# EasyEDA schematic MOTOR_CONTROL.json
TITLE: MOTOR CONTROL; REV: o.0; Date: 2022-07-04; Sheet: 1/1; Drawn By: AmirB@mada.org.il; Company: Blomfield Science Museum
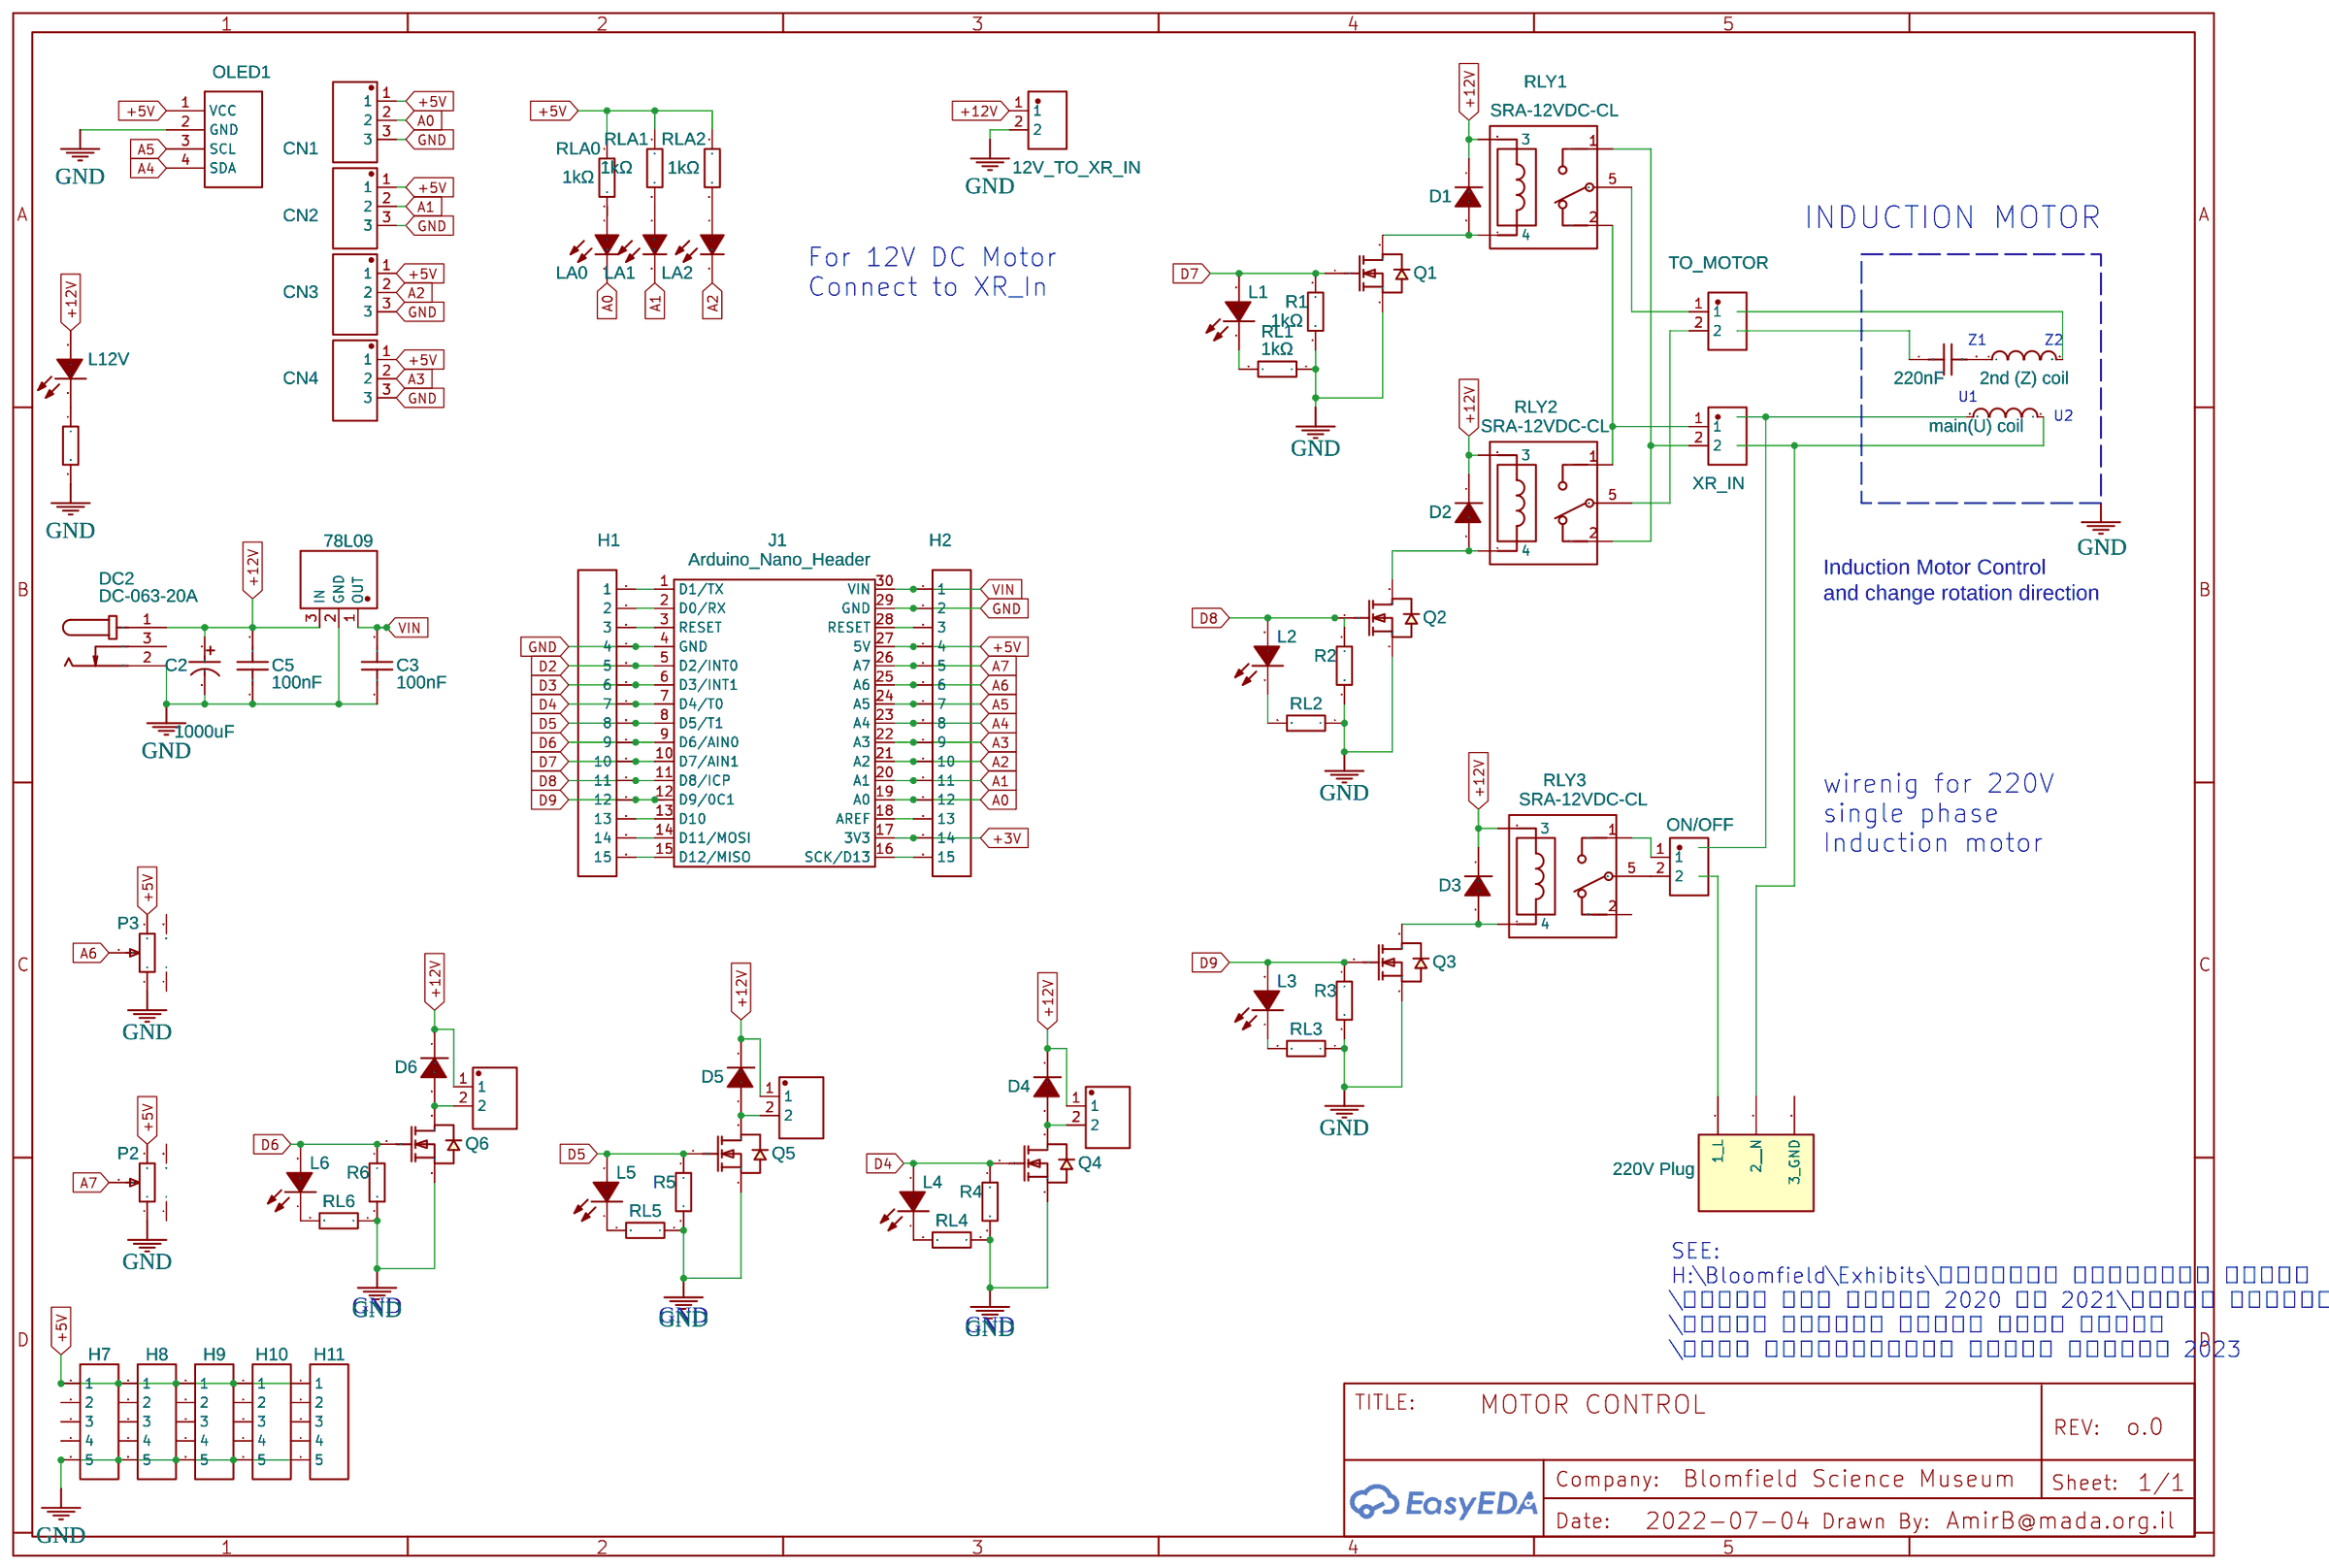
[diagram p0: schematic sheet]

## Parts
12V_TO_XR_IN  12V_TO_R  [CONN-TH_P5.00_KF301-5.0-2P]
ACON1  KF2510-2A  [CONN-TH_KF2510-2A]
ACON2  KF2510-2A  [CONN-TH_KF2510-2A]
ACON3  KF2510-2A  [CONN-TH_KF2510-2A]
C2  1000uF  [CAP-TH_BD12.5-P5.00-D0.6-FD]
C3  100nF  [C0603]
C4  220nF  [C0603]
C5  100nF  [C0603]
CN1  KF2510-3PFlat knitting needle  [CONN-TH_KF2510-3AW]
CN2  KF2510-3PFlat knitting needle  [CONN-TH_KF2510-3AW]
CN3  KF2510-3PFlat knitting needle  [CONN-TH_KF2510-3AW]
CN4  KF2510-3PFlat knitting needle  [CONN-TH_KF2510-3AW]
CR3  ON/OFF  [CONN-TH_P5.00_KF301-5.0-2P]
D1  M7_C95872  [SMA_L4.3-W2.6-LS5.2-RD]
D2  M7_C95872  [SMA_L4.3-W2.6-LS5.2-RD]
D3  M7_C95872  [SMA_L4.3-W2.6-LS5.2-RD]
D4  M7_C95872  [SMA_L4.3-W2.6-LS5.2-RD]
D5  M7_C95872  [SMA_L4.3-W2.6-LS5.2-RD]
D6  M7_C95872  [SMA_L4.3-W2.6-LS5.2-RD]
DC2  DC-063-20A  [DC-IN-TH_DC-063-20A]
H1  HDR-F-2.54_1x15  [HDR-F-2.54_1X15]
H2  HDR-F-2.54_1x15  [HDR-F-2.54_1X15]
H7  HDR-F-2.54_1x5  [HDR-F-2.54_1X5]
H8  HDR-F-2.54_1x5  [HDR-F-2.54_1X5]
H9  HDR-F-2.54_1x5  [HDR-F-2.54_1X5]
H10  HDR-F-2.54_1x5  [HDR-F-2.54_1X5]
H11  HDR-F-2.54_1x5  [HDR-F-2.54_1X5]
J1  Arduino_Nano_Header  [DIP-30_L43.18-W15.24-ARDUINONANO]
L1  FC-2012HRK-620D  [LED0805-RD_RED]
L2  FC-2012HRK-620D  [LED0805-RD_RED]
L3  FC-2012HRK-620D  [LED0805-RD_RED]
L4  FC-2012HRK-620D  [LED0805-RD_RED]
L5  FC-2012HRK-620D  [LED0805-RD_RED]
L6  FC-2012HRK-620D  [LED0805-RD_RED]
L9  main(U) coil  [L0603]
L10  2nd (Z) coil  [L0603]
L12V  FC-2012HRK-620D  [LED0805-RD_RED]
LA0  19-217/BHC-ZL1M2RY/3T  [LED0603-R-RD_BLUE]
LA1  19-217/BHC-ZL1M2RY/3T  [LED0603-R-RD_BLUE]
LA2  19-217/BHC-ZL1M2RY/3T  [LED0603-R-RD_BLUE]
OLED1  1.3 inch OLED SSH1106 I2C 128x64 copy  [1.3_OLED_SSH1106_I2C_128X64_BOARD]
P2  长柄旋转电位器  [RES-ADJ-TH_RV09]
P3  长柄旋转电位器  [RES-ADJ-TH_RV09]
P4  220V Plug  [MAIN VOLTAGE PLUG 1]
Q1  AO3400A  [SOT-23-3_L2.9-W1.6-P1.90-LS2.8-BR]
Q2  AO3400A  [SOT-23-3_L2.9-W1.6-P1.90-LS2.8-BR]
Q3  AO3400A  [SOT-23-3_L2.9-W1.6-P1.90-LS2.8-BR]
Q4  AO3400A  [SOT-23-3_L2.9-W1.6-P1.90-LS2.8-BR]
Q5  AO3400A  [SOT-23-3_L2.9-W1.6-P1.90-LS2.8-BR]
Q6  AO3400A  [SOT-23-3_L2.9-W1.6-P1.90-LS2.8-BR]
R1  1kΩ  [R0603]
R2  1kΩ  [R0603]
R3  1kΩ  [R0603]
R4  1kΩ  [R0603]
R5  1kΩ  [R0603]
R6  1kΩ  [R0603]
RL1  1kΩ  [R0603]
RL2  1kΩ  [R0603]
RL3  1kΩ  [R0603]
RL4  1kΩ  [R0603]
RL5  1kΩ  [R0603]
RL6  1kΩ  [R0603]
RL12V  R10K  [R0603]
RLA0  1kΩ  [R0603]
RLA1  1kΩ  [R0603]
RLA2  1kΩ  [R0603]
RLY1  SRA-12VDC-CL  [RELAY-TH_SRA-X-CX]
RLY2  SRA-12VDC-CL  [RELAY-TH_SRA-X-CX]
RLY3  SRA-12VDC-CL  [RELAY-TH_SRA-X-CX]
TO_MOTOR  TO_MOTOR  [CONN-TH_P5.00_KF301-5.0-2P]
U5  78L09  [SOT-89-3_L4.5-W2.5-P1.50-LS4.0-BR]
XR_IN  XR_IN  [CONN-TH_P5.00_KF301-5.0-2P]

## Library data of the parts
12V_TO_XR_IN CR3 TO_MOTOR XR_IN = KF301-5.0-2P: Supplier: LCSC; Supplier Part: C474881; Manufacturer: Cixi Kefa Elec; Contributor: LCSC; JLCPCB Part Class: Extended Part; Package Display: No
ACON1-ACON3 = KF2510-2A: Supplier: LCSC; Manufacturer: BOOMELE; Supplier Part: C27543; JLCPCB Part Class: Extended Part; Package Display: No
C2 = 1000uF 50V: Supplier: LCSC; Manufacturer: ValuePro; Supplier Part: C18104; JLCPCB Part Class: Extended Part; Package Display: No
C3 C5 = CC0603KRX7R9BB104: Supplier: LCSC; Manufacturer: YAGEO; Supplier Part: C14663; JLCPCB Part Class: Basic Part; Package Display: No
C4 = C_0603_US: Contributor: LCEDA_Lib; Package Display: No
CN1-CN4 = KF2510-3PFlat knitting needle: Supplier: LCSC; Manufacturer: BOOMELE; Supplier Part: C45011; JLCPCB Part Class: Extended Part; Package Display: No
D1-D6 = M7_C95872: Supplier: LCSC; Manufacturer: MDD; Supplier Part: C95872; JLCPCB Part Class: Basic Part; Package Display: No
DC2 = DC-063-20A: Supplier: LCSC; Supplier Part: C707268; Manufacturer: 韩国韩荣; Contributor: LCSC; JLCPCB Part Class: Extended Part; Package Display: No
H1 H2 = HDR-F-2.54_1x15: Supplier Part: C124408; Supplier: LCSC; Contributor: LCEDA_Lib; Package Display: No
H7-H11 = HDR-F-2.54_1x5: Supplier Part: C50950; Supplier: LCSC; Contributor: LCEDA_Lib; Package Display: No
J1 = Arduino_Nano_Header
L1-L6 L12V = FC-2012HRK-620D: Supplier: LCSC; Manufacturer: NATIONSTAR; Supplier Part: C84256; JLCPCB Part Class: Basic Part; Package Display: No
L9 L10 = L0603_US: Contributor: LCEDA_Lib; Package Display: No
LA0-LA2 = 19-217/BHC-ZL1M2RY/3T: Supplier: LCSC; Manufacturer: EVERLIGHT; Supplier Part: C72041; JLCPCB Part Class: Basic Part; Package Display: No
OLED1 = 1.3 inch OLED SSH1106 I2C 128x64 copy: Contributor: Deguello; Package Display: No
P2 P3 = 长柄旋转电位器: Supplier: LCSC; Supplier Part: C2874842; Manufacturer: null; JLCPCB Part Class: Extended Part; Contributor: LCSC; Package Display: No
P4 = Main voltage: LCSC: C49661; Supplier Part: C49661; Supplier: LCSC; Manufacturer: LCSC; Package Display: No
Q1-Q6 = AO3400A: Supplier: LCSC; Manufacturer: AOS; Supplier Part: C20917; JLCPCB Part Class: Basic Part; Package Display: No
R1-R6 RL1-RL6 RLA0-RLA2 = 0603WAF1001T5E: Supplier: LCSC; Manufacturer: UniOhm; Supplier Part: C21190; Resistance (Ohms): 1K; JLCPCB Part Class: Basic Part; Package Display: No
RL12V = 0603WAF1001T5E: Supplier: LCSC; Manufacturer: UniOhm; Manufacturer Part: 0603WAF1002T5E; Supplier Part: C25804; Resistance (Ohms): 10K; JLCPCB Part Class: Basic Part; Package Display: No
RLY1-RLY3 = SRA-12VDC-CL: Supplier: LCSC; Manufacturer: 松乐; Supplier Part: C60169; JLCPCB Part Class: Extended Part; Package Display: No
U5 = 78L09U 78L09: Contributor: LCSC; Supplier: LCSC; Supplier Part: C2875177; Manufacturer: CBI(创基); JLCPCB Part Class: Extended Part; Package Display: No

## Nets
+3V: H2.14 J1.17(3V3)
+5V: CN1.1 CN2.1 CN3.1 CN4.1 H2.4 H7.1 H8.1 H9.1 H10.1 H11.1 J1.27(5V) OLED1.1(VCC) P2.3 P3.3 RLA0.1 RLA1.1 RLA2.1
+12V: 12V_TO_XR_IN.1 ACON1.1 ACON2.1 ACON3.1 C2.1 C5.2 D1.1(K) D2.1(K) D3.1(K) D4.1(K) D5.1(K) D6.1(K) DC2.1 L12V.2(+) RLY1.3 RLY2.3 RLY3.3 U5.3(IN)
GND: 12V_TO_XR_IN.2 C2.2 C3.1 C5.1 CN1.3 CN2.3 CN3.3 CN4.3 DC2.2 H1.4 H2.2 H7.5 H8.5 H9.5 H10.5 H11.5 J1.4(GND) J1.29(GND) OLED1.2(GND) P2.1 P3.1 Q1.2(S) Q2.2(S) Q3.2(S) Q4.2(S) Q5.2(S) Q6.2(S) R1.1 R2.2 R3.2 R4.2 R5.2 R6.2 RL1.1 RL2.1 RL3.1 RL4.1 RL5.1 RL6.1 RL12V.2 U5.2(GND)
VIN: C3.2 H2.1 J1.30(VIN) U5.1(OUT)
A0: CN1.2 H2.12 J1.19(A0) LA0.2(C)
A1: CN2.2 H2.11 J1.20(A1) LA1.2(C)
A2: CN3.2 H2.10 J1.21(A2) LA2.2(C)
A3: CN4.2 H2.9 J1.22(A3)
A4: H2.8 J1.23(A4) OLED1.4(SDA)
A5: H2.7 J1.24(A5) OLED1.3(SCL)
A6: H2.6 J1.25(A6) P3.2
A7: H2.5 J1.26(A7) P2.2
D2: H1.5 J1.5(D2/INT0)
D3: H1.6 J1.6(D3/INT1)
D4: H1.7 J1.7(D4/T0) L4.2(+) Q4.1(G) R4.1
D5: H1.8 J1.8(D5/T1) L5.2(+) Q5.1(G) R5.1
D6: H1.9 J1.9(D6/AIN0) L6.2(+) Q6.1(G) R6.1
D7: H1.10 J1.10(D7/AIN1) L1.2(+) Q1.1(G) R1.2
D8: H1.11 J1.11(D8/ICP) L2.2(+) Q2.1(G) R2.1
D9: H1.12 J1.12(D9/0C1) L3.2(+) Q3.1(G) R3.1
Net-(ACON1-2): ACON1.2 D4.2(A) Q4.3(D)
Net-(ACON2-2): ACON2.2 D5.2(A) Q5.3(D)
Net-(ACON3-2): ACON3.2 D6.2(A) Q6.3(D)
Net-(C4-2): C4.2 L10.1
Net-(CR3-1): CR3.1 RLY3.1
Net-(CR3-2): CR3.2 RLY3.5
Net-(D1-2): D1.2(A) Q1.3(D) RLY1.4
Net-(D2-2): D2.2(A) Q2.3(D) RLY2.4
Net-(D3-2): D3.2(A) Q3.3(D) RLY3.4
Net-(H1-1): H1.1 J1.1(D1/TX)
Net-(H1-2): H1.2 J1.2(D0/RX)
Net-(H1-3): H1.3 J1.3(RESET)
Net-(H1-13): H1.13 J1.13(D10)
Net-(H1-14): H1.14 J1.14(D11/MOSI)
Net-(H1-15): H1.15 J1.15(D12/MISO)
Net-(H2-3): H2.3 J1.28(RESET)
Net-(H2-13): H2.13 J1.18(AREF)
Net-(H2-15): H2.15 J1.16(SCK/D13)
Net-(L1-1): L1.1(-) RL1.2
Net-(L2-1): L2.1(-) RL2.2
Net-(L3-1): L3.1(-) RL3.2
Net-(L4-1): L4.1(-) RL4.2
Net-(L5-1): L5.1(-) RL5.2
Net-(L6-1): L6.1(-) RL6.2
Net-(L9-1): L9.1 P4.2(3 GND)
Net-(L12V-1): L12V.1(-) RL12V.1
Net-(LA0-1): LA0.1(A) RLA0.2
Net-(LA1-1): LA1.1(A) RLA1.2
Net-(LA2-1): LA2.1(A) RLA2.2
Net-(RLY1-1): RLY1.1 RLY2.2 XR_IN.2
Net-(RLY1-2): RLY1.2 RLY2.1 XR_IN.1
Net-(RLY1-5): RLY1.5 TO_MOTOR.1
Net-(RLY2-5): RLY2.5 TO_MOTOR.2

Not connected (* = marked no-connect by the designer): C4 1; DC2 3; H7 2 3 4; H8 2 3 4; H9 2 3 4; H10 2 3 4; H11 2 3 4; L9 2; L10 2; P2 4 5; P3 4 5; P4 1(1 L); RLY3 2

## Notes on the sheet
- INDUCTION MOTOR
- For 12V DC Motor
  Connect to XR_In
- Z1
- Z2
- U1
- U2
- Induction Motor Control
  and change rotation direction
- wirenig for 220V
  single phase
  Induction motor
- SEE:
  H:\Bloomfield\Exhibits\רעיונות לתערוכות חדשות
  \הדפסה תלת ממדית 2020 או 2021\פיתוח מוצגים
  \חתכים שקופים אוריק מנוע סומפי
  \מנוע ואלקטרוניקה למוצג נובמבר 2023
- GND
- GND
- GND
